# Altium schematic sheet hsi2rgb.SchDoc
size A4
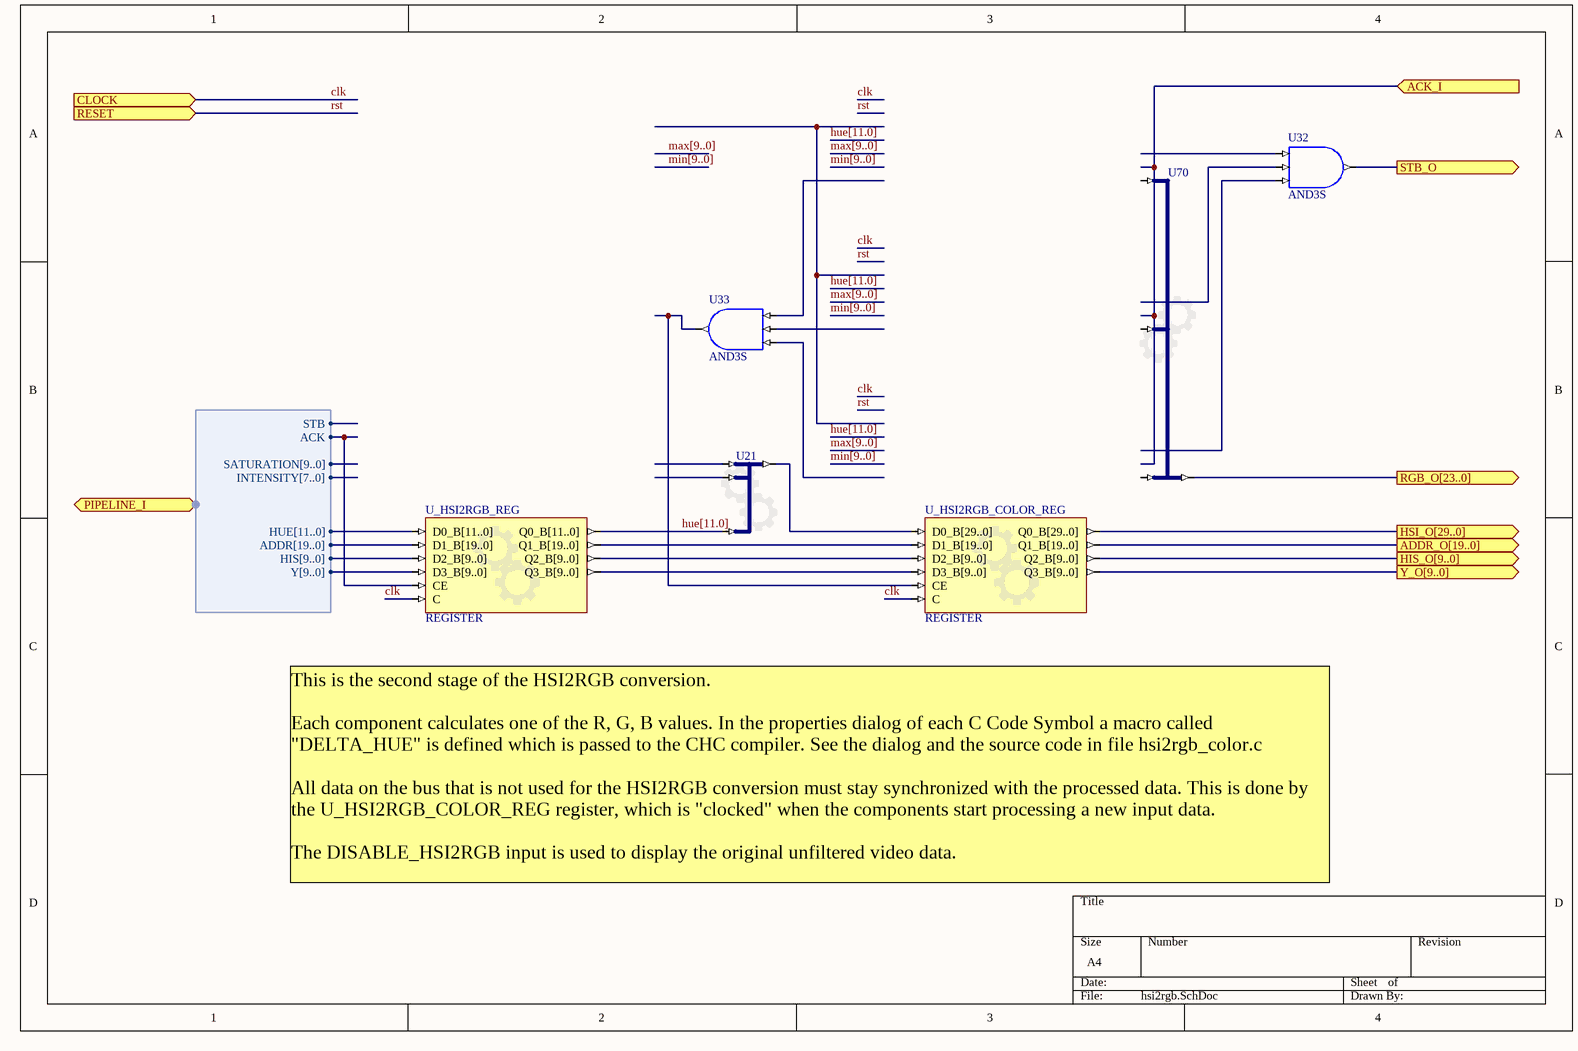
[diagram p0: hsi2rgb.SchDoc]

## Parts
U21  BUS_JS  (value not drawn)
U32  AND3S
U33  AND3S
U70  BUS_JS  (value not drawn)
U_HSI2RGB_COLOR_REG  REGISTER
U_HSI2RGB_REG  REGISTER

## Ports
ACK_I (in), ADDR_O[19..0] (out), CLOCK (in), HIS_O[9..0] (out), HSI_O[29..0] (out), PIPELINE_I (harness H_PIXEL_PIPELINE_1_5), RESET (in), RGB_O[23..0] (out), STB_O (out), Y_O[9..0] (out)

## Harnesses
H_PIXEL_PIPELINE_1_5: ADDR[19..0], Y[9..0], HIS[9..0], HUE[11..0], STB, ACK, INTENSITY[7..0], SATURATION[9..0]

## Nets
ADDR_O[19..0]: U_HSI2RGB_COLOR_REG.Q1_B[19..0] ; port ADDR_O[19..0]
clk: U_HSI2RGB_COLOR_REG.C U_HSI2RGB_REG.C ; port CLOCK
HIS_O[9..0]: U_HSI2RGB_COLOR_REG.Q2_B[9..0] ; port HIS_O[9..0]
HSI_O[29..0]: U_HSI2RGB_COLOR_REG.Q0_B[29..0] ; port HSI_O[29..0]
hue[11.0]: U21.I2_B[11..0] U_HSI2RGB_REG.Q0_B[11..0]
RGB_O[23..0]: U70.O[23..0] ; port RGB_O[23..0]
rst: port RESET
STB_O: U32.O ; port STB_O
Y_O[9..0]: U_HSI2RGB_COLOR_REG.Q3_B[9..0] ; port Y_O[9..0]
NetU21_O[29..0]: U21.O[29..0] U_HSI2RGB_COLOR_REG.D0_B[29..0]
NetU33_O: U33.O U_HSI2RGB_COLOR_REG.CE
NetU_HSI2RGB_COLOR_REG_D1_B[19..0]: U_HSI2RGB_COLOR_REG.D1_B[19..0] U_HSI2RGB_REG.Q1_B[19..0]
NetU_HSI2RGB_COLOR_REG_D2_B[9..0]: U_HSI2RGB_COLOR_REG.D2_B[9..0] U_HSI2RGB_REG.Q2_B[9..0]
NetU_HSI2RGB_COLOR_REG_D3_B[9..0]: U_HSI2RGB_COLOR_REG.D3_B[9..0] U_HSI2RGB_REG.Q3_B[9..0]
NetU_HSI2RGB_REG_CE: U_HSI2RGB_REG.CE ; port PIPELINE_I.ACK
NetU_HSI2RGB_REG_D0_B[11..0]: U_HSI2RGB_REG.D0_B[11..0] ; port PIPELINE_I.HUE[11..0]
NetU_HSI2RGB_REG_D1_B[19..0]: U_HSI2RGB_REG.D1_B[19..0] ; port PIPELINE_I.ADDR[19..0]
NetU_HSI2RGB_REG_D2_B[9..0]: U_HSI2RGB_REG.D2_B[9..0] ; port PIPELINE_I.HIS[9..0]
NetU_HSI2RGB_REG_D3_B[9..0]: U_HSI2RGB_REG.D3_B[9..0] ; port PIPELINE_I.Y[9..0]

Not connected (* = marked no-connect by the designer): U21 I0_B[7..0] I1_B[9..0]; U32 I0 I1 I2; U33 I0 I1 I2; U70 I0_B[7..0] I1_B[7..0] I2_B[7..0]

## Buses and harness runs
bus hue[11.0]
bus max[9..0]
bus min[9..0]

## Notes on the sheet
- This is the second stage of the HSI2RGB conversion.
  Each component calculates one of the R, G, B values. In the properties dialog of each C Code Symbol a macro called "DELTA_HUE" is defined which is passed to the CHC compiler. See the dialog and the source code in file hsi2rgb_color.c
  All data on the bus that is not used for the HSI2RGB conversion must stay synchronized with the processed data. This is done by the U_HSI2RGB_COLOR_REG register, which is "clocked" when the components start processing a new input data.
  The DISABLE_HSI2RGB input is used to display the original unfiltered video data.

## Library data of the parts
U21 = BUS_JS: Configurable Bus Joiner/Splitter; ConfiguratorName: GENERIC_BUS_JS; ConfigurationParameters: {}Version[1.1]{}SplitterJoinerType[Joiner]{}SignalCount[3]{}SignalWidth0[8]{}GapBelow0[1000000]{}ConnectionType0[Pin]{}SignalWidth1[10]{}GapBelow1[4000000]{}ConnectionType1[Pin]{}SignalWidth2[12]{}GapBelow2[1000000]{}ConnectionType2[Pin]{}ShowPinNames[False]{}; LastRevisionNo: 1.00.00; Published: 17-Sep-2008; Publisher: Altium Limited; HelpURL: https://wiki.altium.com/display/ADOH/Configurable+Generic+Library
U32 U33 = AND3S: 3-Input AND Gate, Single Pin Version; XilinxEquivalent: AND3; FunctionalClass: Logic Primitive; PortSize: 3; ArchiveName: GENERIC; VHDLIB_SIM: GENERIC_LIB; Published: 29-Jan-2004; Publisher: Altium Limited; LastRevisionNo: 1.00.00; HelpURL: CR0118 FPGA Generic Library Guide.pdf#page=114; ComponentLink1URL: CR0136 FPGA Logic Primitive Resource Usage.pdf#page=23; ComponentLink1Description: Core &Resource Usage; SubClass: AND; PortStyle: Single Pin Version
U70 = BUS_JS: Configurable Bus Joiner/Splitter; ConfiguratorName: GENERIC_BUS_JS; ConfigurationParameters: {}Version[1.1]{}SplitterJoinerType[Joiner]{}SignalCount[3]{}SignalWidth0[8]{}GapBelow0[11000000]{}ConnectionType0[Pin]{}SignalWidth1[8]{}GapBelow1[11000000]{}ConnectionType1[Pin]{}SignalWidth2[8]{}GapBelow2[1000000]{}ConnectionType2[Pin]{}ShowPinNames[False]{}; LastRevisionNo: 1.00.00; Published: 17-Sep-2008; Publisher: Altium Limited
U_HSI2RGB_COLOR_REG = REGISTER: Configurable Register; ConfiguratorName: GENERIC_REGISTER; ConfigurationParameters: {}Version[1.1]{}RegisterType[DFlipFlop]{}NegativeTrigger[False]{}TriggerEnable[True]{}ResetMode[None]{}SetMode[None]{}SignalCount[4]{}SignalWidth0[30]{}OutputOption0[Normal]{}SignalWidth1[20]{}OutputOption1[Normal]{}SignalWidth2[10]{}OutputOption2[Normal]{}SignalWidth3[10]{}OutputOption3[Normal]{}; LastRevisionNo: 1.00.00; Published: 13-Oct-2008; Publisher: Altium Limited; HelpURL: https://wiki.altium.com/display/ADOH/Configurable+Generic+Library
U_HSI2RGB_REG = REGISTER: Configurable Register; ConfiguratorName: GENERIC_REGISTER; ConfigurationParameters: {}Version[1.1]{}RegisterType[DFlipFlop]{}NegativeTrigger[False]{}TriggerEnable[True]{}ResetMode[None]{}SetMode[None]{}SignalCount[4]{}SignalWidth0[12]{}OutputOption0[Normal]{}SignalWidth1[20]{}OutputOption1[Normal]{}SignalWidth2[10]{}OutputOption2[Normal]{}SignalWidth3[10]{}OutputOption3[Normal]{}; LastRevisionNo: 1.00.00; Published: 13-Oct-2008; Publisher: Altium Limited; HelpURL: https://wiki.altium.com/display/ADOH/Configurable+Generic+Library